# Altium project EG4D_PVS464MB.PrjPcb
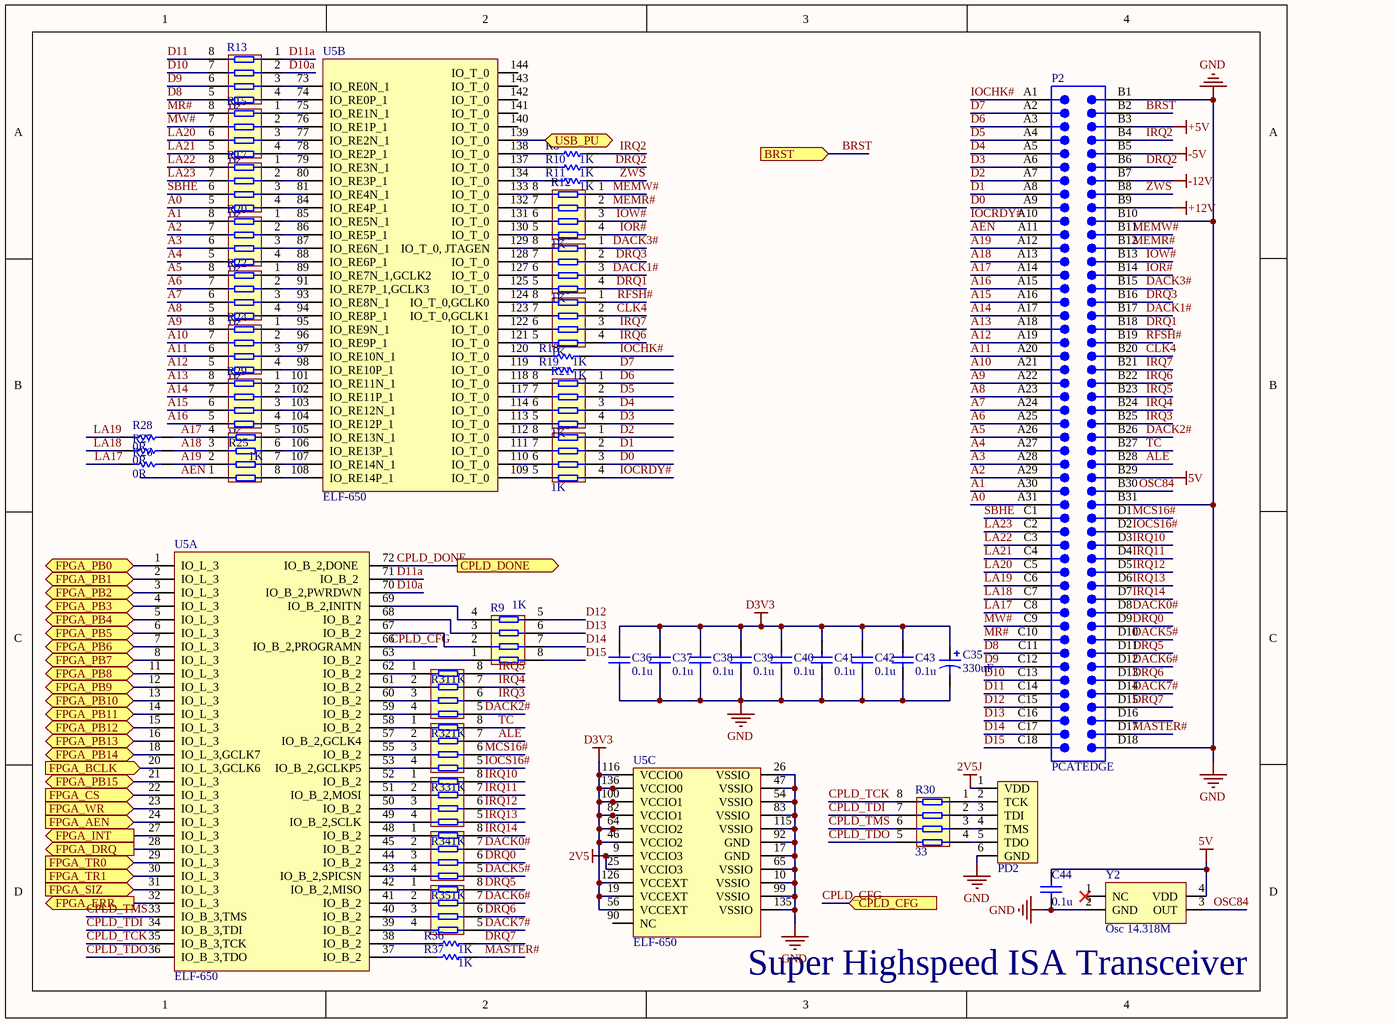
[diagram p0: AT short bus ( 7 x 4.2 inches).schdoc]
4 sheets, 180 parts. Net scope: flat (ports and power ports of the same name join across sheets).
Board file: AT short bus ( 7 x 4.2 inches).PCBDOC
Sheets:
  AT short bus ( 7 x 4.2 inches).schdoc
  MISC.SchDoc
  FPGA_CorePeripherals.SchDoc
  MEM.SchDoc

## Sheet AT short bus ( 7 x 4.2 inches).schdoc: AT short bus ( 7 x 4.2 inches)
size A; Organization: Organization; Address1: Address1; Address2: Address2; Address3: Address3; Address4: Address4; DocumentNumber: 1; Revision: 0; SheetNumber: 2; SheetTotal: 2

### Parts
C35  value 330uF  [TanCap-1210]  (hidden comment: 330u)
C36  value 0.1u  [0603C]  (hidden comment: Cap)
C37  value 0.1u  [0603C]  (hidden comment: Cap)
C38  value 0.1u  [0603C]  (hidden comment: Cap)
C39  value 0.1u  [0603C]  (hidden comment: Cap)
C40  value 0.1u  [0603C]  (hidden comment: Cap)
C41  value 0.1u  [0603C]  (hidden comment: Cap)
C42  value 0.1u  [0603C]  (hidden comment: Cap)
C43  value 0.1u  [0603C]  (hidden comment: Cap)
C44  value 0.1u  [0603C]  (hidden comment: Cap)
P2  PCATEDGE  [PCATEDGE]
PD2  JTAG  [DBGP7]  (value not drawn)
R8  value 1K  [0603R]  (hidden comment: Res1)
R9  1K  [YC164]
R10  value 1K  [0603R]  (hidden comment: Res1)
R11  value 1K  [0603R]  (hidden comment: Res1)
R12  1K  [YC164]
R13  1K  [YC164]
R14  1K  [YC164]
R15  1K  [YC164]
R16  1K  [YC164]
R17  1K  [YC164]
R18  value 1K  [0603R]  (hidden comment: Res1)
R19  value 1K  [0603R]  (hidden comment: Res1)
R20  1K  [YC164]
R21  1K  [YC164]
R22  1K  [YC164]
R23  1K  [YC164]
R24  1K  [YC164]
R25  1K  [YC164]
R26  value 0R  [0603R]  (hidden comment: Res1)
R27  value 0R  [0603R]  (hidden comment: Res1)
R28  value 0R  [0603R]  (hidden comment: Res1)
R29  1K  [YC164]
R30  33  [YC164]
R31  1K  [YC164]
R32  1K  [YC164]
R33  1K  [YC164]
R34  1K  [YC164]
R35  1K  [YC164]
R36  value 1K  [0603R]  (hidden comment: Res1)
R37  value 1K  [0603R]  (hidden comment: Res1)
U5  ELF-650  [LQFP144-1]  (parts A,B,C of 3)
Y2  Osc 14.318M  [XTAL-3225]

### Ports
BRST (in), CPLD_CFG (in), CPLD_DONE (out), FPGA_AEN (in), FPGA_BCLK (in), FPGA_CS (in), FPGA_DRQ (out), FPGA_ERR (out), FPGA_INT (out), FPGA_PB0 (bidir), FPGA_PB1 (bidir), FPGA_PB2 (bidir), FPGA_PB3 (bidir), FPGA_PB4 (bidir), FPGA_PB5 (bidir), FPGA_PB6 (bidir), FPGA_PB7 (bidir), FPGA_PB8 (bidir), FPGA_PB9 (bidir), FPGA_PB10 (bidir), FPGA_PB11 (bidir), FPGA_PB12 (bidir), FPGA_PB13 (bidir), FPGA_PB14 (bidir), FPGA_PB15 (bidir), FPGA_SIZ (in), FPGA_TR0 (in), FPGA_TR1 (in), FPGA_WR (in), USB_PU (bidir)

### Nets
2V5: U5.9(VCCIO3) U5.25(VCCIO3)
2V5J: PD2.1(VDD)
5V: C44.2 P2.B29 Y2.4(VDD)
+5V: P2.B3
+12V: P2.B9
-5V: P2.B5
-12V: P2.B7
D3V3: C35.1 C36.1 C37.1 C38.1 C39.1 C40.1 C41.1 C42.1 C43.1 U5.19(VCCEXT) U5.46(VCCIO2) U5.56(VCCEXT) U5.64(VCCIO2) U5.82(VCCIO1) U5.100(VCCIO1) U5.116(VCCIO0) U5.126(VCCEXT) U5.136(VCCIO0)
GND: C35.2 C36.2 C37.2 C38.2 C39.2 C40.2 C41.2 C42.2 C43.2 C44.1 P2.B1 P2.B10 P2.B31 P2.D18 PD2.6(GND) U5.10(VSSIO) U5.17(GND) U5.26(VSSIO) U5.47(VSSIO) U5.54(VSSIO) U5.65(VSSIO) U5.83(VSSIO) U5.92(GND) U5.99(VSSIO) U5.115(VSSIO) U5.135(VSSIO) Y2.2(GND)
A0: P2.A31 R17.5
A1: P2.A30 R20.8
A2: P2.A29 R20.7
A3: P2.A28 R20.6
A4: P2.A27 R20.5
A5: P2.A26 R22.8
A6: P2.A25 R22.7
A7: P2.A24 R22.6
A8: P2.A23 R22.5
A9: P2.A22 R24.8
A10: P2.A21 R24.7
A11: P2.A20 R24.6
A12: P2.A19 R24.5
A13: P2.A18 R29.8
A14: P2.A17 R29.7
A15: P2.A16 R29.6
A16: P2.A15 R29.5
A17: P2.A14 R25.4 R28.2
A18: P2.A13 R25.3 R27.2
A19: P2.A12 R25.2 R26.2
AEN: P2.A11 R25.1
ALE: P2.B28 R32.7
BRST: P2.B2 ; port BRST
CLK4: P2.B20 R16.2
CPLD_CFG: U5.66(IO_B_2,PROGRAMN) ; port CPLD_CFG
CPLD_DONE: U5.72(IO_B_2,DONE) ; port CPLD_DONE
CPLD_TCK: R30.8 U5.35(IO_B_3,TCK)
CPLD_TDI: R30.7 U5.34(IO_B_3,TDI)
CPLD_TDO: R30.5 U5.36(IO_B_3,TDO)
CPLD_TMS: R30.6 U5.33(IO_B_3,TMS)
D0: P2.A9 R23.3
D1: P2.A8 R23.2
D2: P2.A7 R23.1
D3: P2.A6 R21.4
D4: P2.A5 R21.3
D5: P2.A4 R21.2
D6: P2.A3 R21.1
D7: P2.A2 R19.1
D8: P2.C11 R13.5
D9: P2.C12 R13.6
D10: P2.C13 R13.7
D10a: R13.2 U5.70(IO_B_2,PWRDWN)
D11: P2.C14 R13.8
D11a: R13.1 U5.71(IO_B_2)
D12: P2.C15 R9.5
D13: P2.C16 R9.6
D14: P2.C17 R9.7
D15: P2.C18 R9.8
DACK0#: P2.D8 R34.7
DACK1#: P2.B17 R14.3
DACK2#: P2.B26 R31.5
DACK3#: P2.B15 R14.1
DACK5#: P2.D10 R34.5
DACK6#: P2.D12 R35.7
DACK7#: P2.D14 R35.5
DRQ0: P2.D9 R34.6
DRQ1: P2.B18 R14.4
DRQ2: P2.B6 R10.1
DRQ3: P2.B16 R14.2
DRQ5: P2.D11 R35.8
DRQ6: P2.D13 R35.6
DRQ7: P2.D15 R36.1
IOCHK#: P2.A1 R18.1
IOCRDY#: P2.A10 R23.4
IOCS16#: P2.D2 R32.5
IOR#: P2.B14 R12.4
IOW#: P2.B13 R12.3
IRQ2: P2.B4 R8.1
IRQ3: P2.B25 R31.6
IRQ4: P2.B24 R31.7
IRQ5: P2.B23 R31.8
IRQ6: P2.B22 R16.4
IRQ7: P2.B21 R16.3
IRQ10: P2.D3 R33.8
IRQ11: P2.D4 R33.7
IRQ12: P2.D5 R33.6
IRQ13: P2.D6 R33.5
IRQ14: P2.D7 R34.8
LA17: P2.C8 R26.1
LA18: P2.C7 R27.1
LA19: P2.C6 R28.1
LA20: P2.C5 R15.6
LA21: P2.C4 R15.5
LA22: P2.C3 R17.8
LA23: P2.C2 R17.7
MASTER#: P2.D17 R37.1
MCS16#: P2.D1 R32.6
MEMR#: P2.B12 R12.2
MEMW#: P2.B11 R12.1
MR#: P2.C10 R15.8
MW#: P2.C9 R15.7
OSC84: P2.B30 Y2.3(OUT)
RFSH#: P2.B19 R16.1
SBHE: P2.C1 R17.6
TC: P2.B27 R32.8
ZWS: P2.B8 R11.1
NetPD2_2: PD2.2(TCK) R30.1
NetPD2_3: PD2.3(TDI) R30.2
NetPD2_4: PD2.4(TMS) R30.3
NetPD2_5: PD2.5(TDO) R30.4
NetR8_2: R8.2 U5.138(IO_T_0)
NetR9_1: R9.1 U5.63(IO_B_2)
NetR9_2: R9.2 U5.67(IO_B_2)
NetR9_3: R9.3 U5.68(IO_B_2)
NetR9_4: R9.4 U5.69(IO_B_2,INITN)
NetR10_2: R10.2 U5.137(IO_T_0)
NetR11_2: R11.2 U5.134(IO_T_0)
NetR12_5: R12.5 U5.130(IO_T_0)
NetR12_6: R12.6 U5.131(IO_T_0)
NetR12_7: R12.7 U5.132(IO_T_0)
NetR12_8: R12.8 U5.133(IO_T_0)
NetR13_3: R13.3 U5.73(IO_RE0N_1)
NetR13_4: R13.4 U5.74(IO_RE0P_1)
NetR14_5: R14.5 U5.125(IO_T_0)
NetR14_6: R14.6 U5.127(IO_T_0)
NetR14_7: R14.7 U5.128(IO_T_0)
NetR14_8: R14.8 U5.129(IO_T_0,_JTAGEN)
NetR15_1: R15.1 U5.75(IO_RE1N_1)
NetR15_2: R15.2 U5.76(IO_RE1P_1)
NetR15_3: R15.3 U5.77(IO_RE2N_1)
NetR15_4: R15.4 U5.78(IO_RE2P_1)
NetR16_5: R16.5 U5.121(IO_T_0)
NetR16_6: R16.6 U5.122(IO_T_0)
NetR16_7: R16.7 U5.123(IO_T_0,GCLK1)
NetR16_8: R16.8 U5.124(IO_T_0,GCLK0)
NetR17_1: R17.1 U5.79(IO_RE3N_1)
NetR17_2: R17.2 U5.80(IO_RE3P_1)
NetR17_3: R17.3 U5.81(IO_RE4N_1)
NetR17_4: R17.4 U5.84(IO_RE4P_1)
NetR18_2: R18.2 U5.120(IO_T_0)
NetR19_2: R19.2 U5.119(IO_T_0)
NetR20_1: R20.1 U5.85(IO_RE5N_1)
NetR20_2: R20.2 U5.86(IO_RE5P_1)
NetR20_3: R20.3 U5.87(IO_RE6N_1)
NetR20_4: R20.4 U5.88(IO_RE6P_1)
NetR21_5: R21.5 U5.113(IO_T_0)
NetR21_6: R21.6 U5.114(IO_T_0)
NetR21_7: R21.7 U5.117(IO_T_0)
NetR21_8: R21.8 U5.118(IO_T_0)
NetR22_1: R22.1 U5.89(IO_RE7N_1,GCLK2)
NetR22_2: R22.2 U5.91(IO_RE7P_1,GCLK3)
NetR22_3: R22.3 U5.93(IO_RE8N_1)
NetR22_4: R22.4 U5.94(IO_RE8P_1)
NetR23_5: R23.5 U5.109(IO_T_0)
NetR23_6: R23.6 U5.110(IO_T_0)
NetR23_7: R23.7 U5.111(IO_T_0)
NetR23_8: R23.8 U5.112(IO_T_0)
NetR24_1: R24.1 U5.95(IO_RE9N_1)
NetR24_2: R24.2 U5.96(IO_RE9P_1)
NetR24_3: R24.3 U5.97(IO_RE10N_1)
NetR24_4: R24.4 U5.98(IO_RE10P_1)
NetR25_5: R25.5 U5.105(IO_RE13N_1)
NetR25_6: R25.6 U5.106(IO_RE13P_1)
NetR25_7: R25.7 U5.107(IO_RE14N_1)
NetR25_8: R25.8 U5.108(IO_RE14P_1)
NetR29_1: R29.1 U5.101(IO_RE11N_1)
NetR29_2: R29.2 U5.102(IO_RE11P_1)
NetR29_3: R29.3 U5.103(IO_RE12N_1)
NetR29_4: R29.4 U5.104(IO_RE12P_1)
NetR31_1: R31.1 U5.62(IO_B_2)
NetR31_2: R31.2 U5.61(IO_B_2)
NetR31_3: R31.3 U5.60(IO_B_2)
NetR31_4: R31.4 U5.59(IO_B_2)
NetR32_1: R32.1 U5.58(IO_B_2)
NetR32_2: R32.2 U5.57(IO_B_2,GCLK4)
NetR32_3: R32.3 U5.55(IO_B_2)
NetR32_4: R32.4 U5.53(IO_B_2,GCLKP5)
NetR33_1: R33.1 U5.52(IO_B_2)
NetR33_2: R33.2 U5.51(IO_B_2,MOSI)
NetR33_3: R33.3 U5.50(IO_B_2)
NetR33_4: R33.4 U5.49(IO_B_2,SCLK)
NetR34_1: R34.1 U5.48(IO_B_2)
NetR34_2: R34.2 U5.45(IO_B_2)
NetR34_3: R34.3 U5.44(IO_B_2)
NetR34_4: R34.4 U5.43(IO_B_2,SPICSN)
NetR35_1: R35.1 U5.42(IO_B_2,MISO)
NetR35_2: R35.2 U5.41(IO_B_2)
NetR35_3: R35.3 U5.40(IO_B_2)
NetR35_4: R35.4 U5.39(IO_B_2)
NetR36_2: R36.2 U5.38(IO_B_2)
NetR37_2: R37.2 U5.37(IO_B_2)
NetR52_1: U5.139(IO_T_0) ; port USB_PU
NetU1_2: U5.32(IO_L_3) ; port FPGA_ERR
NetU1_3: U5.31(IO_L_3) ; port FPGA_SIZ
NetU1_4: U5.30(IO_L_3) ; port FPGA_TR1
NetU1_6: U5.29(IO_L_3) ; port FPGA_TR0
NetU1_8: U5.28(IO_L_3) ; port FPGA_DRQ
NetU1_11: U5.27(IO_L_3) ; port FPGA_INT
NetU1_14: U5.24(IO_L_3) ; port FPGA_AEN
NetU1_15: U5.23(IO_L_3) ; port FPGA_WR
NetU1_16: U5.22(IO_L_3) ; port FPGA_CS
NetU1_17: U5.21(IO_L_3) ; port FPGA_PB15
NetU1_19: U5.20(IO_L_3,GCLK6) ; port FPGA_BCLK
NetU1_22: U5.18(IO_L_3,GCLK7) ; port FPGA_PB14
NetU1_23: U5.16(IO_L_3) ; port FPGA_PB13
NetU1_25: U5.15(IO_L_3) ; port FPGA_PB12
NetU1_26: U5.14(IO_L_3) ; port FPGA_PB11
NetU1_27: U5.13(IO_L_3) ; port FPGA_PB10
NetU1_28: U5.12(IO_L_3) ; port FPGA_PB9
NetU1_29: U5.11(IO_L_3) ; port FPGA_PB8
NetU1_30: U5.8(IO_L_3) ; port FPGA_PB7
NetU1_31: U5.7(IO_L_3) ; port FPGA_PB6
NetU1_32: U5.6(IO_L_3) ; port FPGA_PB5
NetU1_35: U5.5(IO_L_3) ; port FPGA_PB4
NetU1_36: U5.4(IO_L_3) ; port FPGA_PB3
NetU1_37: U5.3(IO_L_3) ; port FPGA_PB2
NetU1_39: U5.2(IO_L_3) ; port FPGA_PB1
NetU1_41: U5.1(IO_L_3) ; port FPGA_PB0

Not connected (* = marked no-connect by the designer): P2 D16; U5 90(NC_) 140(IO_T_0) 141(IO_T_0) 142(IO_T_0) 143(IO_T_0) 144(IO_T_0); Y2 1(NC)*

### Notes on the sheet
- Super Highspeed ISA Transceiver

### Library data of the parts
C35 = Cap Pol1: Polarized Capacitor (Radial); Published: 8-Jun-2000; LatestRevisionDate: 17-Jul-2002; LatestRevisionNote: Re-released for DXP Platform.; PackageReference: RB7.6-15; Publisher: Altium Limited; PackageDescription: Polarized Capacitor (Radial); 2 Leads
C36-C44 = Cap: Capacitor; Published: 8-Jun-2000; LatestRevisionDate: 17-Jul-2002; LatestRevisionNote: Re-released for DXP Platform.; PackageReference: RAD-0.3; Publisher: Altium Limited; PackageDescription: Radial Cap, Thru-Hole; 2 Leads; 0.3 in Pin Spacing
P2 = PCATEDGE: Card, 98-Position; Text Field6: Alternate Layout Available; Text Field7: Published 14-Feb-2002
R8 R10 R11 R18 R19 R26-R28 R36 R37 = Res1: Resistor; Published: 8-Jun-2000; LatestRevisionDate: 17-Jul-2002; LatestRevisionNote: Re-released for DXP Platform.; PackageReference: AXIAL-0.3; Publisher: Altium Limited; PackageDescription: Axial Device, Thru-Hole; 2 Leads; 0.3 in Pin Spacing
R9 R12-R17 R20-R25 R29-R35 = ResPak-8P4R
U5 = EF1A650LQ144: GP CPLD
Y2 = OSC

## Sheet MISC.SchDoc
size A4
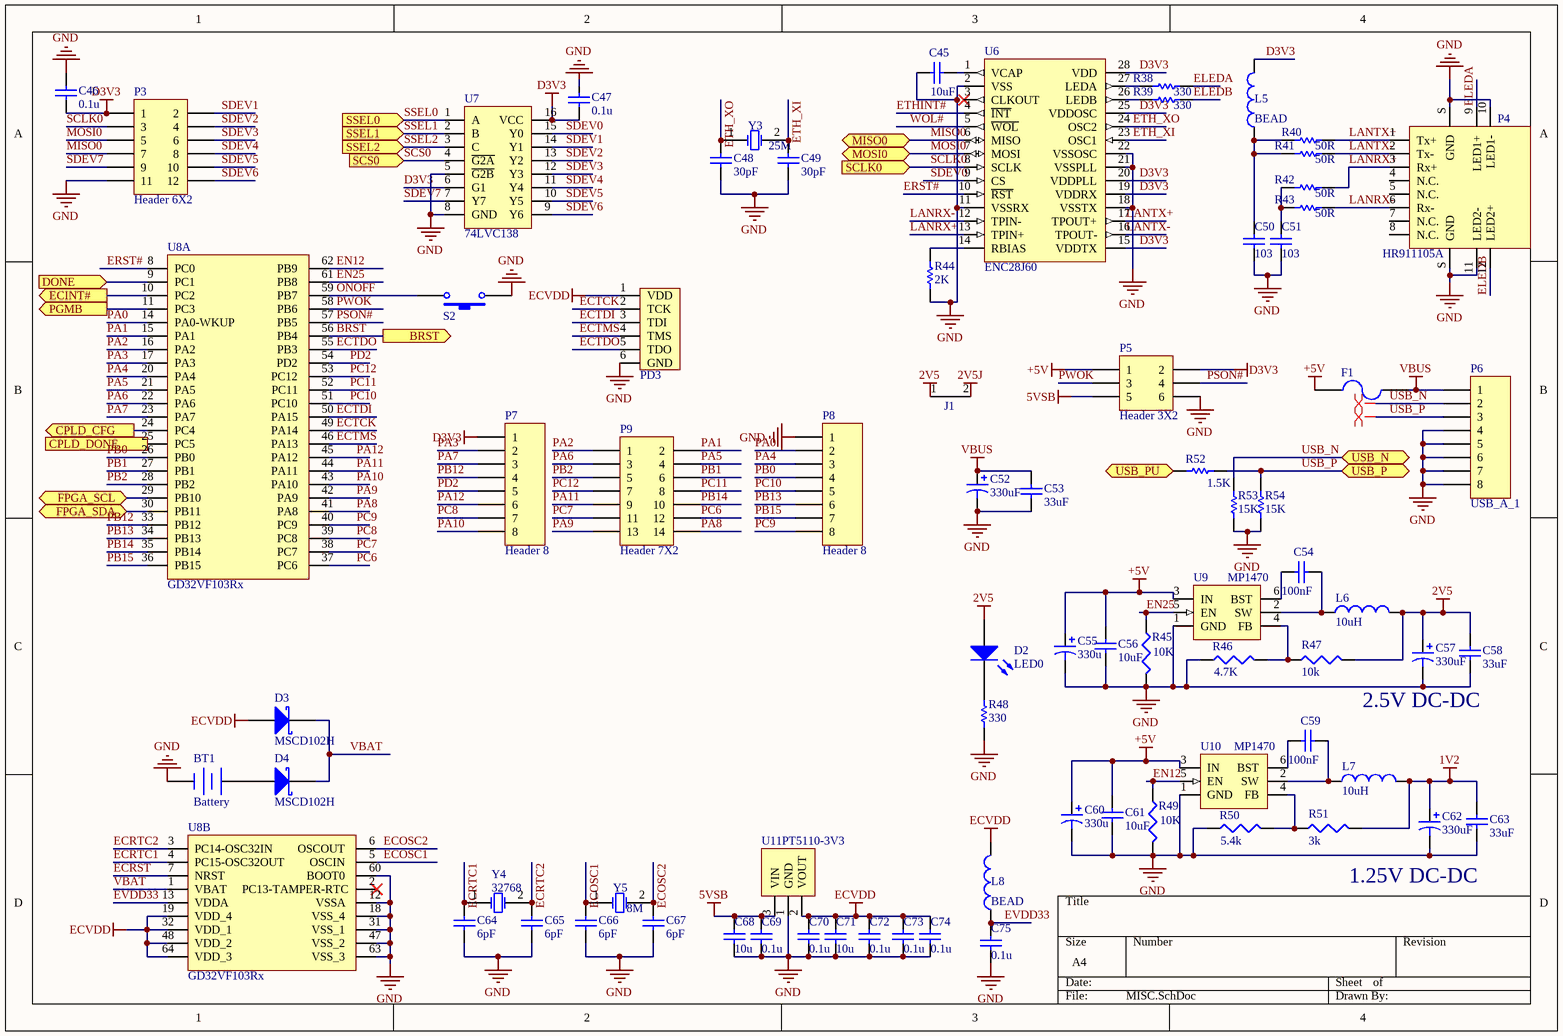
[diagram p1: MISC.SchDoc]

### Parts
BT1  Battery  [BAT-CR1220]
C45  value 10uF  [0603C]  (hidden comment: Cap)
C46  value 0.1u  [0603C]  (hidden comment: Cap)
C47  value 0.1u  [0603C]  (hidden comment: Cap)
C48  value 30pF  [0603C]  (hidden comment: Cap)
C49  value 30pF  [0603C]  (hidden comment: Cap)
C50  value 103  [0603C]  (hidden comment: Cap)
C51  value 103  [0603C]  (hidden comment: Cap)
C52  value 330uF  [TanCap-1210]  (hidden comment: 330u)
C53  value 33uF  [0603C]  (hidden comment: 106)
C54  value 100nF  [0603C]  (hidden comment: 104)
C55  330u  [TanCap-1210]
C56  value 10uF  [0603C]  (hidden comment: 106)
C57  value 330uF  [TanCap-1210]  (hidden comment: 330u)
C58  value 33uF  [0603C]  (hidden comment: 106)
C59  value 100nF  [0603C]  (hidden comment: 104)
C60  330u  [TanCap-1210]
C61  value 10uF  [0603C]  (hidden comment: 106)
C62  value 330uF  [TanCap-1210]  (hidden comment: 330u)
C63  value 33uF  [0603C]  (hidden comment: 106)
C64  value 6pF  [0603C]  (hidden comment: Cap)
C65  value 6pF  [0603C]  (hidden comment: Cap)
C66  value 6pF  [0603C]  (hidden comment: Cap)
C67  value 6pF  [0603C]  (hidden comment: Cap)
C68  value 10u  [0603C]  (hidden comment: Cap)
C69  value 0.1u  [0603C]  (hidden comment: Cap)
C70  value 0.1u  [0603C]  (hidden comment: Cap)
C71  value 10u  [0603C]  (hidden comment: Cap)
C72  value 0.1u  [0603C]  (hidden comment: Cap)
C73  value 0.1u  [0603C]  (hidden comment: Cap)
C74  value 0.1u  [0603C]  (hidden comment: Cap)
C75  value 0.1u  [0603C]  (hidden comment: Cap)
D2  LED0  [0805LED1]
D3  MSCD102H  [0805LED2]
D4  MSCD102H  [0805LED2]
F1  Fuse 2  [Fusebux_5x20]  (value not drawn)
J1  Jumper  [Jumper 10mm]  (value not drawn)
L5  value BEAD  [0603C]  (hidden comment: Inductor)
L6  10uH  [PIND0650]
L7  10uH  [PIND0650]
L8  value BEAD  [0603C]  (hidden comment: Inductor)
P3  Header 6X2  [HDR2X6]
P4  HR911105A  [HR911105A]
P5  Header 3X2  [PWRCONN-6P]
P6  USB_A_1  [USB-A_1]
P7  Header 8  [HDR1X8]
P8  Header 8  [HDR1X8]
P9  Header 7X2  [HDR2X7_U]
PD3  JTAG  [DBGP7]  (value not drawn)
R38  value 330  [0603R]  (hidden comment: Res1)
R39  value 330  [0603R]  (hidden comment: Res1)
R40  value 50R  [0603R]  (hidden comment: Res1)
R41  value 50R  [0603R]  (hidden comment: Res1)
R42  value 50R  [0603R]  (hidden comment: Res1)
R43  value 50R  [0603R]  (hidden comment: Res1)
R44  value 2K  [0603R]  (hidden comment: Res1)
R45  10K  [0603R]
R46  value 4.7K  [0603R]  (hidden comment: 3K2)
R47  10K  [0603R]
R48  value 330  [0603R]  (hidden comment: Res1)
R49  10K  [0603R]
R50  value 5.4k  [0603R]  (hidden comment: 3K2)
R51  value 3k  [0603R]  (hidden comment: 10K)
R52  value 1.5K  [0603R]  (hidden comment: Res1)
R53  value 15K  [0603R]  (hidden comment: Res1)
R54  value 15K  [0603R]  (hidden comment: Res1)
S2  SW-PB  [Switch_SMT-022S-H2.5]  (value not drawn)
U6  ENC28J60  [SOIC28P1040X265]
U7  74LVC138  [SO-16]
U8  GD32VF103Rx  [QFP12X12-64(N)]  (parts A,B of 2)
U9  MP1470  [SOT95P245X110-6N]
U10  MP1470  [SOT95P245X110-6N]
U11  PT5110-3V3  [SOT323-N]
Y3  25M  [XTAL-5032]
Y4  32768  [XTAL-3215]
Y5  8M  [XTAL-5032]

### Ports
BRST (out), CPLD_CFG (out), CPLD_DONE (in), DONE (in), ECINT# (out), FPGA_SCL (bidir), FPGA_SDA (bidir), MISO0 (bidir), MOSI0 (bidir), PGMB (out), SCLK0 (in), SCS0 (in), SSEL0 (in), SSEL1 (in), SSEL2 (in), USB_N (bidir), USB_P (bidir), USB_PU (bidir)

### Nets
1V2: C62.1 C63.2 L7.2 R51.2
2V5: C57.1 C58.2 D2.1(A) J1.1 L6.2 R47.2
2V5J: J1.2
5VSB: C68.2 C69.2 P5.5 U11.3(VIN)
+5V: C55.1 C56.2 C60.1 C61.2 F1.1 P5.1 U9.3(IN) U10.3(IN)
D3V3: C46.2 C47.2 L5.2 P3.1 P5.2 P7.1 U6.15(VDDTX) U6.19(VDDRX) U6.20(VDDPLL) U6.25(VDDOSC) U6.28(VDD) U7.6(G1) U7.16(VCC)
ECVDD: C70.2 C71.2 C72.2 C73.2 C74.2 D3.1(A) L8.2 PD3.1(VDD) U8.19(VDD_4) U8.32(VDD_1) U8.48(VDD_2) U8.64(VDD_3) U11.2(VOUT)
GND: BT1.2(-) C45.2 C46.1 C47.1 C48.2 C49.2 C50.1 C51.1 C52.2 C53.1 C55.2 C56.1 C57.2 C58.1 C60.2 C61.1 C62.2 C63.1 C64.2 C65.2 C66.2 C67.2 C68.1 C69.1 C70.1 C71.1 C72.1 C73.1 C74.1 C75.1 P3.11 P4.10(LED1-) P4.11(LED2-) P4.S(GND) P5.6 P6.4 P6.5 P6.6 P6.7 P6.8 P8.1 PD3.6(GND) R44.2 R45.2 R46.1 R48.2 R49.2 R50.1 R53.2 R54.2 S2.1 U6.2(VSS) U6.11(VSSRX) U6.18(VSSTX) U6.21(VSSPLL) U6.22(VSSOSC) U7.5(~{G2B}) U7.8(GND) U8.12(VSSA) U8.18(VSS_4) U8.31(VSS_1) U8.47(VSS_2) U8.60(BOOT0) U8.63(VSS_3) U9.1(GND) U10.1(GND) U11.1(GND)
VBUS: C52.1 C53.2 F1.2 P6.1
BRST: U8.56(PB4) ; port BRST
CPLD_CFG: U8.24(PC4) ; port CPLD_CFG
CPLD_DONE: U8.25(PC5) ; port CPLD_DONE
DONE: U8.9(PC1) ; port DONE
ECOSC1: C66.1 U8.5(OSCIN) Y5.1(OSC1)
ECOSC2: C67.1 U8.6(OSCOUT) Y5.2(OSC2)
ECRST: U8.7(NRST)
ECRTC1: C64.1 U8.4(PC15-OSC32OUT) Y4.1(OSC1)
ECRTC2: C65.1 U8.3(PC14-OSC32IN) Y4.2(OSC2)
ECTCK: PD3.2(TCK) U8.49(PA14)
ECTDI: PD3.3(TDI) U8.50(PA15)
ECTDO: PD3.5(TDO) U8.55(PB3)
ECTMS: PD3.4(TMS) U8.46(PA13)
ELEDA: P4.9(LED1+) R38.1
ELEDB: P4.12(LED2+) R39.1
EN12: R49.1 U8.62(PB9) U10.5(EN)
EN25: R45.1 U8.61(PB8) U9.5(EN)
ERST#: U6.10(~{RST}) U8.8(PC0)
ETH_XI: C49.1 U6.23(OSC1) Y3.2(OSC2)
ETH_XO: C48.1 U6.24(OSC2) Y3.1(OSC1)
ETHINT#: U6.4(~{INT})
EVDD33: C75.2 L8.1 U8.13(VDDA)
INITB: U8.10(PC2) ; port ECINT#
LANRX+: P4.3(Rx+) R42.1 U6.13(TPIN+)
LANRX-: P4.6(Rx-) R43.1 U6.12(TPIN-)
LANTX+: P4.1(Tx+) R40.1 U6.17(TPOUT+)
LANTX-: P4.2(Tx-) R41.1 U6.16(TPOUT-)
MISO0: P3.7 U6.6(MISO) ; port MISO0
MOSI0: P3.5 U6.7(MOSI) ; port MOSI0
ONOFF: S2.2 U8.59(PB7)
PA0: P8.2 U8.14(PA0-WKUP)
PA1: P9.2 U8.15(PA1)
PA2: P9.1 U8.16(PA2)
PA3: P7.2 U8.17(PA3)
PA4: P8.3 U8.20(PA4)
PA5: P9.4 U8.21(PA5)
PA6: P9.3 U8.22(PA6)
PA7: P7.3 U8.23(PA7)
PA8: P9.14 U8.41(PA8)
PA9: P9.13 U8.42(PA9)
PA10: P7.8 U8.43(PA10)
PA11: P9.9 U8.44(PA11)
PA12: P7.6 U8.45(PA12)
PB0: P8.4 U8.26(PB0)
PB1: P9.6 U8.27(PB1)
PB2: P9.5 U8.28(PB2)
PB12: P7.4 U8.33(PB12)
PB13: P8.6 U8.34(PB13)
PB14: P9.10 U8.35(PB14)
PB15: P8.7 U8.36(PB15)
PC6: P9.12 U8.37(PC6)
PC7: P9.11 U8.38(PC7)
PC8: P7.7 U8.39(PC8)
PC9: P8.8 U8.40(PC9)
PC10: P8.5 U8.51(PC10)
PC11: P9.8 U8.52(PC11)
PC12: P9.7 U8.53(PC12)
PD2: P7.5 U8.54(PD2)
PGMB: U8.11(PC3) ; port PGMB
PSON#: P5.4 U8.57(PB5)
PWOK: P5.3 U8.58(PB6)
SCLK0: P3.3 U6.8(SCLK) ; port SCLK0
SCS0: U7.4(~{G2A}) ; port SCS0
SDEV0: U6.9(CS) U7.15(Y0)
SDEV1: P3.2 U7.14(Y1)
SDEV2: P3.4 U7.13(Y2)
SDEV3: P3.6 U7.12(Y3)
SDEV4: P3.8 U7.11(Y4)
SDEV5: P3.10 U7.10(Y5)
SDEV6: P3.12 U7.9(Y6)
SDEV7: P3.9 U7.7(Y7)
SSEL0: U7.1(A) ; port SSEL0
SSEL1: U7.2(B) ; port SSEL1
SSEL2: U7.3(C) ; port SSEL2
USB_N: P6.2 R53.1 ; port USB_N
USB_P: P6.3 R52.2 R54.1 ; port USB_P
VBAT: D3.2(K) D4.2(K) U8.1(VBAT)
WOL#: U6.5(~{WOL})
NetBT1_1: BT1.1(+) D4.1(A)
NetC45_1: C45.1 U6.1(VCAP)
NetC50_2: C50.2 L5.1 R40.2 R41.2
NetC51_2: C51.2 R42.2 R43.2
NetC54_1: C54.1 L6.1 U9.2(SW)
NetC54_2: C54.2 U9.6(BST)
NetC59_1: C59.1 L7.1 U10.2(SW)
NetC59_2: C59.2 U10.6(BST)
NetD2_2: D2.2(K) R48.1
NetP10_71: U8.29(PB10) ; port FPGA_SCL
NetP10_72: U8.30(PB11) ; port FPGA_SDA
NetR38_2: R38.2 U6.27(LEDA)
NetR39_2: R39.2 U6.26(LEDB)
NetR44_1: R44.1 U6.14(RBIAS)
NetR46_2: R46.2 R47.1 U9.4(FB)
NetR50_2: R50.2 R51.1 U10.4(FB)
NetR52_1: R52.1 ; port USB_PU

Not connected (* = marked no-connect by the designer): P4 4(N.C.) 5(N.C.) 7(N.C.) 8(N.C.); U6 3(CLKOUT)*; U8 2(PC13-TAMPER-RTC)*

### Layout directives
differential pair: USB_N, USB_P

### Notes on the sheet
- 2.5V DC-DC
- 1.25V DC-DC

### Library data of the parts
BT1 = Battery: Multicell Battery; Published: 24-Mar-1999; LatestRevisionDate: 17-Jul-2002; LatestRevisionNote: Re-released for DXP Platform.; PackageReference: BAT-2; Publisher: Altium Limited; PackageDescription: Battery; 2 Leads
C45-C51 C64-C75 = Cap: Capacitor; Published: 8-Jun-2000; LatestRevisionDate: 17-Jul-2002; LatestRevisionNote: Re-released for DXP Platform.; PackageReference: RAD-0.3; Publisher: Altium Limited; PackageDescription: Radial Cap, Thru-Hole; 2 Leads; 0.3 in Pin Spacing
C52 C55 C57 C60 C62 = Cap Pol1: Polarized Capacitor (Radial); Published: 8-Jun-2000; LatestRevisionDate: 17-Jul-2002; LatestRevisionNote: Re-released for DXP Platform.; PackageReference: RB7.6-15; Publisher: Altium Limited; PackageDescription: Polarized Capacitor (Radial); 2 Leads
  C55 C60: Value: 330u
C53 C54 C56 C58 C59 C61 C63 = Cap: Ceramic Capacitor 0603; Published: 8-Jun-2000; LatestRevisionDate: 17-Jul-2002; LatestRevisionNote: Re-released for DXP Platform.; PackageReference: RAD-0.3; Publisher: Altium Limited; PackageDescription: Radial Cap, Thru-Hole; 2 Leads; 0.3 in Pin Spacing
D2 = LED0: Typical INFRARED GaAs LED; Published: 8-Jun-2000; LatestRevisionDate: 08-Jul-2005; LatestRevisionNote: Mech Layer 1 removed.; PackageReference: LED-0; Publisher: Altium Limited; PackageDescription: LED; 2 Leads
D3 D4 = D Schottky: Schottky Diode; Published: 8-Jun-2000; LatestRevisionDate: 17-Jul-2002; LatestRevisionNote: Re-released for DXP Platform.; PackageReference: SMB; Publisher: Altium Limited; PackageDescription: DO-214-AA/SMB; 2 C-Bend Leads; Body 5.3 x 3.6 mm, inc. leads (LxW); Code_JEDEC: DO-214-AA
F1 = Fuse 2: Fuse; Published: 8-Jun-2000; LatestRevisionDate: 17-Jul-2002; LatestRevisionNote: Re-released for DXP Platform.; PackageReference: PIN-W2/E2.8; Publisher: Altium Limited; PackageDescription: Thru-Hole; 2 Leads
L5 L8 = Inductor: Code_IEC: 1005; Published: 8-Jun-2000; LatestRevisionDate: 29-May-2009; LatestRevisionNote: IPC-7351 Footprint Added.; PackageReference: 0402-A; Publisher: Altium Limited; PackageDescription: Chip Inductor; Code_JEITA: 0402
L6 L7 = Inductor: Inductor 0606; Code_IEC: 1005; Published: 8-Jun-2000; LatestRevisionDate: 29-May-2009; LatestRevisionNote: IPC-7351 Footprint Added.; PackageReference: 0402-A; Publisher: Altium Limited; PackageDescription: Chip Inductor; Code_JEITA: 0402; Value: 10uH
P3 = Header 6X2: Header, 6-Pin, Dual row; LatestRevisionDate: 17-Jul-2002; LatestRevisionNote: Re-released for DXP Platform.; Publisher: Altium Limited
P5 = Header 3X2: Header, 3-Pin, Dual row; LatestRevisionDate: 17-Jul-2002; LatestRevisionNote: Re-released for DXP Platform.; Publisher: Altium Limited
P6-P8 = Header 8: Header, 8-Pin; LatestRevisionDate: 17-Jul-2002; LatestRevisionNote: Re-released for DXP Platform.; Publisher: Altium Limited
P9 = Header 7X2: Header, 7-Pin, Dual row; LatestRevisionDate: 17-Jul-2002; LatestRevisionNote: Re-released for DXP Platform.; Publisher: Altium Limited
R38-R44 R48 R52-R54 = Res1: Resistor; Published: 8-Jun-2000; LatestRevisionDate: 17-Jul-2002; LatestRevisionNote: Re-released for DXP Platform.; PackageReference: AXIAL-0.3; Publisher: Altium Limited; PackageDescription: Axial Device, Thru-Hole; 2 Leads; 0.3 in Pin Spacing
R45-R47 R49-R51 = Res3: Resistor; Published: 8-Jun-2000; LatestRevisionDate: 29-May-2009; LatestRevisionNote: IPC-7351 Footprint Added.; PackageReference: J1-0603; Publisher: Altium Limited; PackageDescription: Chip Resistor
  R45 R49: Value: 10K
  R47: Value: 10k
S2 = SW-PB: Switch; Published: 24-Mar-1999; LatestRevisionDate: 17-Jul-2002; LatestRevisionNote: Re-released for DXP Platform.; PackageReference: SPST-2; Publisher: Altium Limited; PackageDescription: Switch; 2 Leads
U7 = 74x138
U11 = PT5110
Y3-Y5 = XTAL: Crystal Oscillator; Published: 8-Jun-2000; LatestRevisionDate: 17-Jul-2002; LatestRevisionNote: Re-released for DXP Platform.; PackageReference: R38; Publisher: Altium Limited; PackageDescription: Crystal, Thru-Hole; 2 Leads; Body 3.1 x 8.2 mm (Dia.xH)

## Sheet FPGA_CorePeripherals.SchDoc
size A4
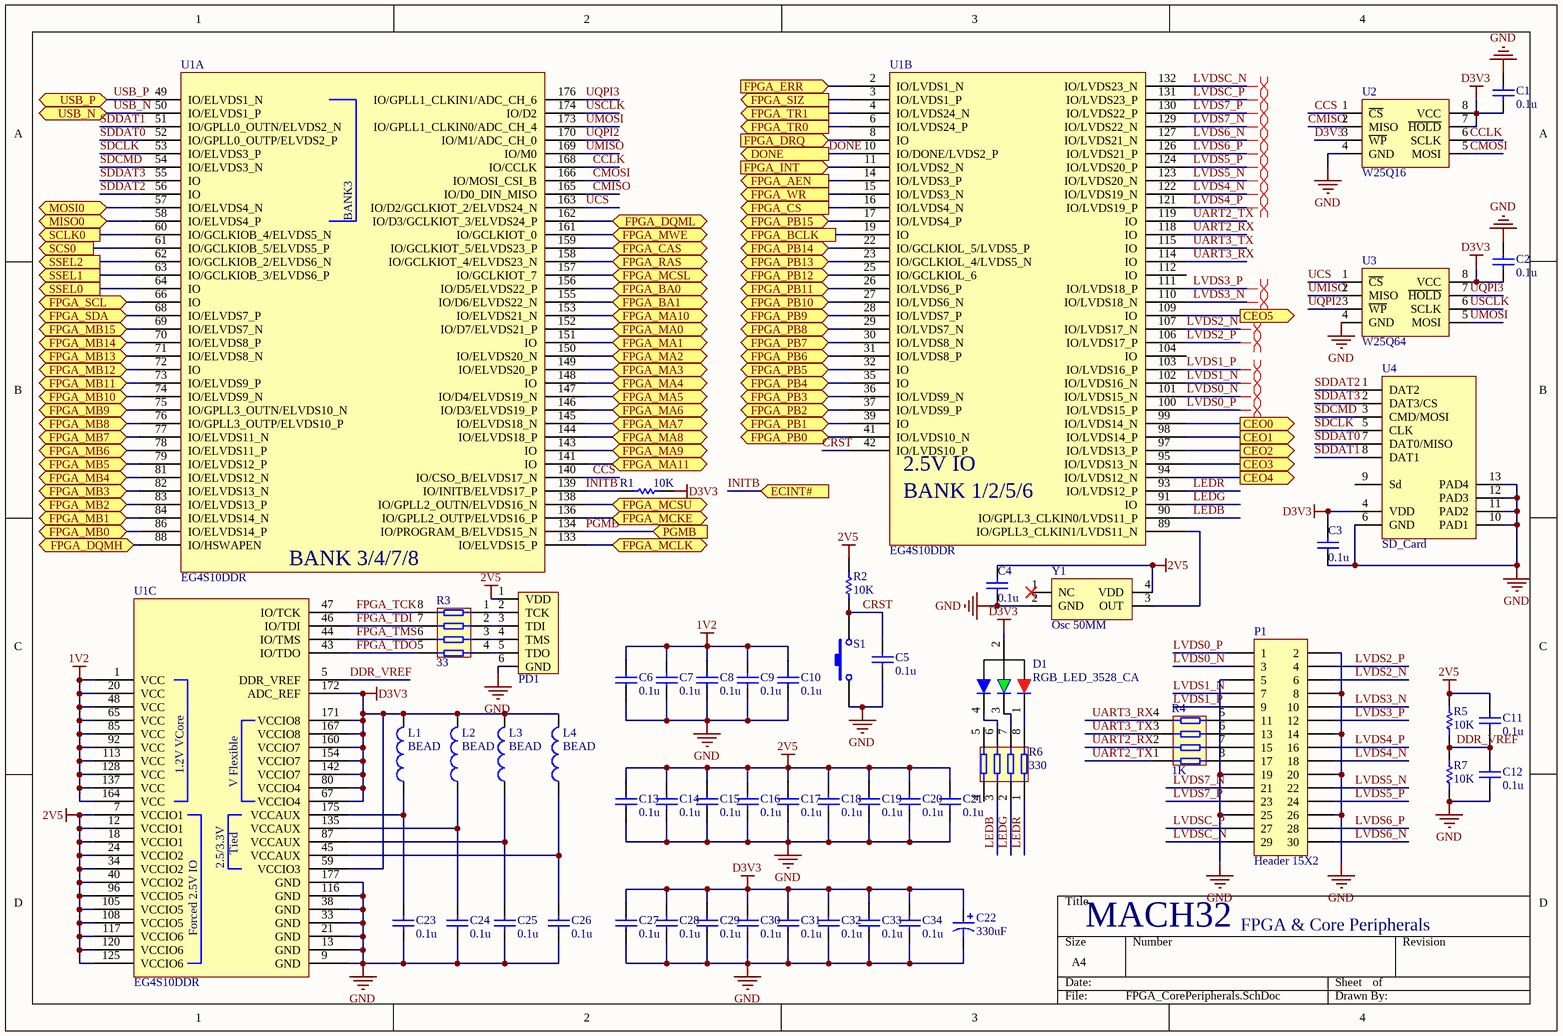
[diagram p2: FPGA_CorePeripherals.SchDoc]

### Parts
C1  value 0.1u  [0603C]  (hidden comment: Cap)
C2  value 0.1u  [0603C]  (hidden comment: Cap)
C3  value 0.1u  [0603C]  (hidden comment: Cap)
C4  value 0.1u  [0603C]  (hidden comment: Cap)
C5  value 0.1u  [0603C]  (hidden comment: Cap)
C6  value 0.1u  [0603C]  (hidden comment: Cap)
C7  value 0.1u  [0603C]  (hidden comment: Cap)
C8  value 0.1u  [0603C]  (hidden comment: Cap)
C9  value 0.1u  [0603C]  (hidden comment: Cap)
C10  value 0.1u  [0603C]  (hidden comment: Cap)
C11  value 0.1u  [0603C]  (hidden comment: Cap)
C12  value 0.1u  [0603C]  (hidden comment: Cap)
C13  value 0.1u  [0603C]  (hidden comment: Cap)
C14  value 0.1u  [0603C]  (hidden comment: Cap)
C15  value 0.1u  [0603C]  (hidden comment: Cap)
C16  value 0.1u  [0603C]  (hidden comment: Cap)
C17  value 0.1u  [0603C]  (hidden comment: Cap)
C18  value 0.1u  [0603C]  (hidden comment: Cap)
C19  value 0.1u  [0603C]  (hidden comment: Cap)
C20  value 0.1u  [0603C]  (hidden comment: Cap)
C21  value 0.1u  [0603C]  (hidden comment: Cap)
C22  value 330uF  [TanCap-1210]  (hidden comment: 330u)
C23  value 0.1u  [0603C]  (hidden comment: Cap)
C24  value 0.1u  [0603C]  (hidden comment: Cap)
C25  value 0.1u  [0603C]  (hidden comment: Cap)
C26  value 0.1u  [0603C]  (hidden comment: Cap)
C27  value 0.1u  [0603C]  (hidden comment: Cap)
C28  value 0.1u  [0603C]  (hidden comment: Cap)
C29  value 0.1u  [0603C]  (hidden comment: Cap)
C30  value 0.1u  [0603C]  (hidden comment: Cap)
C31  value 0.1u  [0603C]  (hidden comment: Cap)
C32  value 0.1u  [0603C]  (hidden comment: Cap)
C33  value 0.1u  [0603C]  (hidden comment: Cap)
C34  value 0.1u  [0603C]  (hidden comment: Cap)
D1  RGB_LED_3528_CA  [LED3528-RGB]
L1  value BEAD  [0603C]  (hidden comment: Inductor)
L2  value BEAD  [0603C]  (hidden comment: Inductor)
L3  value BEAD  [0603C]  (hidden comment: Inductor)
L4  value BEAD  [0603C]  (hidden comment: Inductor)
P1  Header 15X2  [BTB_1.27mm_2x10_SMT]
PD1  JTAG  [DBGP7]  (value not drawn)
R1  value 10K  [0603R]  (hidden comment: Res1)
R2  value 10K  [0603R]  (hidden comment: Res1)
R3  33  [YC164]
R4  1K  [YC164]
R5  value 10K  [0603R]  (hidden comment: Res1)
R6  330  [YC164]
R7  value 10K  [0603R]  (hidden comment: Res1)
S1  SW-PB  [Switch_SMT-022S-H2.5]  (value not drawn)
U1  EG4S10DDR  [EQFP176]  (parts A,B,C of 3)
U2  W25Q16  [SOP8N-127P600X200]
U3  W25Q64  [DIP8]
U4  SD_Card  [TF_self-eject]
Y1  Osc 50MM  [XTAL-3225]

### Ports
CEO0 (out), CEO1 (out), CEO2 (out), CEO3 (out), CEO4 (out), CEO5 (out), DONE (out), ECINT# (in), FPGA_AEN (out), FPGA_BA0 (bidir), FPGA_BA1 (bidir), FPGA_BCLK (out), FPGA_CAS (bidir), FPGA_CS (out), FPGA_DQMH (bidir), FPGA_DQML (bidir), FPGA_DRQ (in), FPGA_ERR (in), FPGA_INT (in), FPGA_MA0 (bidir), FPGA_MA1 (bidir), FPGA_MA2 (bidir), FPGA_MA3 (bidir), FPGA_MA4 (bidir), FPGA_MA5 (bidir), FPGA_MA6 (bidir), FPGA_MA7 (bidir), FPGA_MA8 (bidir), FPGA_MA9 (bidir), FPGA_MA10 (bidir), FPGA_MA11 (bidir), FPGA_MB0 (bidir), FPGA_MB1 (bidir), FPGA_MB2 (bidir), FPGA_MB3 (bidir), FPGA_MB4 (bidir), FPGA_MB5 (bidir), FPGA_MB6 (bidir), FPGA_MB7 (bidir), FPGA_MB8 (bidir), FPGA_MB9 (bidir), FPGA_MB10 (bidir), FPGA_MB11 (bidir), FPGA_MB12 (bidir), FPGA_MB13 (bidir), FPGA_MB14 (bidir), FPGA_MB15 (bidir), FPGA_MCKE (bidir), FPGA_MCLK (bidir), FPGA_MCSL (bidir), FPGA_MCSU (bidir), FPGA_MWE (bidir), FPGA_PB0 (bidir), FPGA_PB1 (bidir), FPGA_PB2 (bidir), FPGA_PB3 (bidir), FPGA_PB4 (bidir), FPGA_PB5 (bidir), FPGA_PB6 (bidir), FPGA_PB7 (bidir), FPGA_PB8 (bidir), FPGA_PB9 (bidir), FPGA_PB10 (bidir), FPGA_PB11 (bidir), FPGA_PB12 (bidir), FPGA_PB13 (bidir), FPGA_PB14 (bidir), FPGA_PB15 (bidir), FPGA_RAS (bidir), FPGA_SCL (bidir), FPGA_SDA (bidir), FPGA_SIZ (out), FPGA_TR0 (out), FPGA_TR1 (out), FPGA_WR (out), MISO0 (bidir), MOSI0 (bidir), PGMB (in), SCLK0 (out), SCS0 (out), SSEL0 (out), SSEL1 (out), SSEL2 (out), USB_N (bidir), USB_P (bidir)

### Nets
1V2: C6.1 C7.1 C8.1 C9.1 C10.1 U1.1(VCC) U1.20(VCC) U1.48(VCC) U1.65(VCC) U1.85(VCC) U1.92(VCC) U1.113(VCC) U1.128(VCC) U1.137(VCC) U1.164(VCC)
2V5: C4.2 C11.1 C13.1 C14.1 C15.1 C16.1 C17.1 C18.1 C19.1 C20.1 C21.1 PD1.1(VDD) R2.2 R5.1 U1.7(VCCIO1) U1.12(VCCIO1) U1.18(VCCIO1) U1.24(VCCIO2) U1.34(VCCIO2) U1.40(VCCIO2) U1.96(VCCIO5) U1.105(VCCIO5) U1.108(VCCIO5) U1.117(VCCIO6) U1.120(VCCIO6) U1.125(VCCIO6) Y1.4(VDD)
D3V3: C1.2 C2.2 C3.2 C22.1 C27.1 C28.1 C29.1 C30.1 C31.1 C32.1 C33.1 C34.1 D1.2 L1.2 L2.2 L3.2 L4.2 R1.2 U1.59(VCCIO3) U1.67(VCCIO4) U1.80(VCCIO4) U1.142(VCCIO7) U1.154(VCCIO7) U1.160(VCCIO7) U1.167(VCCIO8) U1.171(VCCIO8) U1.172(ADC_REF) U2.3(~{WP}) U2.7(~{HOLD}) U2.8(VCC) U3.8(VCC) U4.4(VDD)
GND: C1.1 C2.1 C3.1 C4.1 C5.2 C6.2 C7.2 C8.2 C9.2 C10.2 C12.2 C13.2 C14.2 C15.2 C16.2 C17.2 C18.2 C19.2 C20.2 C21.2 C22.2 C23.2 C24.2 C25.2 C26.2 C27.2 C28.2 C29.2 C30.2 C31.2 C32.2 C33.2 C34.2 P1.2 P1.5 P1.8 P1.14 P1.19 P1.20 P1.25 P1.26 PD1.6(GND) R7.2 S1.1 U1.9(GND) U1.13(GND) U1.21(GND) U1.33(GND) U1.38(GND) U1.116(GND) U1.177(GND) U2.4(GND) U3.4(GND) U4.6(GND) U4.10(PAD1) U4.11(PAD2) U4.12(PAD3) U4.13(PAD4) Y1.2(GND)
CCLK: U1.168(IO/CCLK) U2.6(SCLK)
CCS: U1.140(IO/CSO_B/ELVDS17_N) U2.1(~{CS})
CMISO: U1.165(IO/D0_DIN_MISO) U2.2(MISO)
CMOSI: U1.166(IO/MOSI_CSI_B) U2.5(MOSI)
CRST: C5.1 R2.1 S1.2 U1.42(IO/LVDS10_P)
DDR_VREF: C11.2 C12.1 R5.2 R7.1 U1.5(DDR_VREF)
DONE: U1.10(IO/DONE/LVDS2_P) ; port DONE
DQMH: U1.88(IO/HSWAPEN) ; port FPGA_DQMH
DQML: U1.162(IO/D3/GCLKIOT_3/ELVDS24_P) ; port FPGA_DQML
FPGA_MB0: U1.86(IO/ELVDS14_P) ; port FPGA_MB0
FPGA_MB1: U1.84(IO/ELVDS14_N) ; port FPGA_MB1
FPGA_MB2: U1.83(IO/ELVDS13_P) ; port FPGA_MB2
FPGA_MB3: U1.82(IO/ELVDS13_N) ; port FPGA_MB3
FPGA_MB4: U1.81(IO/ELVDS12_N) ; port FPGA_MB4
FPGA_MB5: U1.79(IO/ELVDS12_P) ; port FPGA_MB5
FPGA_MB6: U1.78(IO/ELVDS11_P) ; port FPGA_MB6
FPGA_MB7: U1.77(IO/ELVDS11_N) ; port FPGA_MB7
FPGA_MB8: U1.76(IO/GPLL3_OUTP/ELVDS10_P) ; port FPGA_MB8
FPGA_MB9: U1.75(IO/GPLL3_OUTN/ELVDS10_N) ; port FPGA_MB9
FPGA_MB10: U1.74(IO/ELVDS9_N) ; port FPGA_MB10
FPGA_MB11: U1.73(IO/ELVDS9_P) ; port FPGA_MB11
FPGA_MB12: U1.72(IO) ; port FPGA_MB12
FPGA_MB13: U1.71(IO/ELVDS8_N) ; port FPGA_MB13
FPGA_MB14: U1.70(IO/ELVDS8_P) ; port FPGA_MB14
FPGA_MB15: U1.69(IO/ELVDS7_N) ; port FPGA_MB15
FPGA_TCK: R3.8 U1.47(IO/TCK)
FPGA_TDI: R3.7 U1.46(IO/TDI)
FPGA_TDO: R3.5 U1.43(IO/TDO)
FPGA_TMS: R3.6 U1.44(IO/TMS)
INITB: R1.1 U1.139(IO/INITB/ELVDS17_P) ; port ECINT#
LEDB: R6.3 U1.90(IO/GPLL3_CLKIN0/LVDS11_P)
LEDG: R6.2 U1.91(IO)
LEDR: R6.1 U1.93(IO/LVDS12_P)
LVDS0_N: P1.3 U1.101(IO/LVDS15_N)
LVDS0_P: P1.1 U1.100(IO/LVDS15_P)
LVDS1_N: P1.7 U1.102(IO/LVDS16_N)
LVDS1_P: P1.9 U1.103(IO/LVDS16_P)
LVDS2_N: P1.6 U1.107(IO/LVDS17_N)
LVDS2_P: P1.4 U1.106(IO/LVDS17_P)
LVDS3_N: P1.10 U1.110(IO/LVDS18_N)
LVDS3_P: P1.12 U1.111(IO/LVDS18_P)
LVDS4_N: P1.18 U1.122(IO/LVDS19_N)
LVDS4_P: P1.16 U1.121(IO/LVDS19_P)
LVDS5_N: P1.22 U1.123(IO/LVDS20_N)
LVDS5_P: P1.24 U1.124(IO/LVDS20_P)
LVDS6_N: P1.30 U1.127(IO/LVDS21_N)
LVDS6_P: P1.28 U1.126(IO/LVDS21_P)
LVDS7_N: P1.21 U1.129(IO/LVDS22_N)
LVDS7_P: P1.23 U1.130(IO/LVDS22_P)
LVDSC_N: P1.29 U1.132(IO/LVDS23_N)
LVDSC_P: P1.27 U1.131(IO/LVDS23_P)
MISO0: U1.58(IO/ELVDS4_P) ; port MISO0
MOSI0: U1.57(IO/ELVDS4_N) ; port MOSI0
PGMB: U1.134(IO/PROGRAM_B/ELVDS15_N) ; port PGMB
SCLK0: U1.60(IO/GCLKIOB_4/ELVDS5_N) ; port SCLK0
SCS0: U1.61(IO/GCLKIOB_5/ELVDS5_P) ; port SCS0
SDCLK: U1.53(IO/ELVDS3_P) U4.5(CLK)
SDCMD: U1.54(IO/ELVDS3_N) U4.3(CMD/MOSI)
SDDAT0: U1.52(IO/GPLL0_OUTP/ELVDS2_P) U4.7(DAT0/MISO)
SDDAT1: U1.51(IO/GPLL0_OUTN/ELVDS2_N) U4.8(DAT1)
SDDAT2: U1.56(IO) U4.1(DAT2)
SDDAT3: U1.55(IO) U4.2(DAT3/CS)
SSEL0: U1.64(IO) ; port SSEL0
SSEL1: U1.63(IO/GCLKIOB_3/ELVDS6_P) ; port SSEL1
SSEL2: U1.62(IO/GCLKIOB_2/ELVDS6_N) ; port SSEL2
UART2_RX: R4.2 U1.118(IO)
UART2_TX: R4.1 U1.119(IO)
UART3_RX: R4.4 U1.114(IO)
UART3_TX: R4.3 U1.115(IO)
UCS: U1.163(IO/D2/GCLKIOT_2/ELVDS24_N) U3.1(~{CS})
UMISO: U1.169(IO/M0) U3.2(MISO)
UMOSI: U1.173(IO/GPLL1_CLKIN0/ADC_CH_4) U3.5(MOSI)
UQPI2: U1.170(IO/M1/ADC_CH_0) U3.3(~{WP})
UQPI3: U1.176(IO/GPLL1_CLKIN1/ADC_CH_6) U3.7(~{HOLD})
USB_N: U1.50(IO/ELVDS1_P) ; port USB_N
USB_P: U1.49(IO/ELVDS1_N) ; port USB_P
USCLK: U1.174(IO/D2) U3.6(SCLK)
NetC23_1: C23.1 L1.1 U1.175(VCCAUX)
NetC24_1: C24.1 L2.1 U1.135(VCCAUX)
NetC25_1: C25.1 L3.1 U1.87(VCCAUX)
NetC26_1: C26.1 L4.1 U1.45(VCCAUX)
NetD1_1: D1.1 R6.8
NetD1_3: D1.3 R6.7
NetD1_4: D1.4 R6.6
NetP1_11: P1.11 R4.5
NetP1_13: P1.13 R4.6
NetP1_15: P1.15 R4.7
NetP1_17: P1.17 R4.8
NetP10_26: U1.161(IO/GCLKIOT_0) ; port FPGA_MWE
NetP10_27: U1.159(IO/GCLKIOT_5/ELVDS23_P) ; port FPGA_CAS
NetP10_28: U1.158(IO/GCLKIOT_4/ELVDS23_N) ; port FPGA_RAS
NetP10_29: U1.157(IO/GCLKIOT_7) ; port FPGA_MCSL
NetP10_30: U1.156(IO/D5/ELVDS22_P) ; port FPGA_BA0
NetP10_31: U1.155(IO/D6/ELVDS22_N) ; port FPGA_BA1
NetP10_32: U1.153(IO/ELVDS21_N) ; port FPGA_MA10
NetP10_33: U1.152(IO/D7/ELVDS21_P) ; port FPGA_MA0
NetP10_34: U1.151(IO) ; port FPGA_MA1
NetP10_35: U1.150(IO/ELVDS20_N) ; port FPGA_MA2
NetP10_36: U1.149(IO/ELVDS20_P) ; port FPGA_MA3
NetP10_37: U1.148(IO) ; port FPGA_MA4
NetP10_38: U1.147(IO/D4/ELVDS19_N) ; port FPGA_MA5
NetP10_39: U1.146(IO/D3/ELVDS19_P) ; port FPGA_MA6
NetP10_40: U1.145(IO/ELVDS18_N) ; port FPGA_MA7
NetP10_41: U1.144(IO/ELVDS18_P) ; port FPGA_MA8
NetP10_42: U1.143(IO) ; port FPGA_MA9
NetP10_43: U1.141(IO) ; port FPGA_MA11
NetP10_44: U1.138(IO/GPLL2_OUTN/ELVDS16_N) ; port FPGA_MCSU
NetP10_45: U1.136(IO/GPLL2_OUTP/ELVDS16_P) ; port FPGA_MCKE
NetP10_46: U1.133(IO/ELVDS15_P) ; port FPGA_MCLK
NetP10_71: U1.66(IO) ; port FPGA_SCL
NetP10_72: U1.68(IO/ELVDS7_P) ; port FPGA_SDA
NetPD1_2: PD1.2(TCK) R3.1
NetPD1_3: PD1.3(TDI) R3.2
NetPD1_4: PD1.4(TMS) R3.3
NetPD1_5: PD1.5(TDO) R3.4
NetU1_2: U1.2(IO/LVDS1_N) ; port FPGA_ERR
NetU1_3: U1.3(IO/LVDS1_P) ; port FPGA_SIZ
NetU1_4: U1.4(IO/LVDS24_N) ; port FPGA_TR1
NetU1_6: U1.6(IO/LVDS24_P) ; port FPGA_TR0
NetU1_8: U1.8(IO) ; port FPGA_DRQ
NetU1_11: U1.11(IO/LVDS2_N) ; port FPGA_INT
NetU1_14: U1.14(IO/LVDS3_P) ; port FPGA_AEN
NetU1_15: U1.15(IO/LVDS3_N) ; port FPGA_WR
NetU1_16: U1.16(IO/LVDS4_N) ; port FPGA_CS
NetU1_17: U1.17(IO/LVDS4_P) ; port FPGA_PB15
NetU1_19: U1.19(IO) ; port FPGA_BCLK
NetU1_22: U1.22(IO/GCLKIOL_5/LVDS5_P) ; port FPGA_PB14
NetU1_23: U1.23(IO/GCLKIOL_4/LVDS5_N) ; port FPGA_PB13
NetU1_25: U1.25(IO/GCLKIOL_6) ; port FPGA_PB12
NetU1_26: U1.26(IO/LVDS6_P) ; port FPGA_PB11
NetU1_27: U1.27(IO/LVDS6_N) ; port FPGA_PB10
NetU1_28: U1.28(IO/LVDS7_P) ; port FPGA_PB9
NetU1_29: U1.29(IO/LVDS7_N) ; port FPGA_PB8
NetU1_30: U1.30(IO/LVDS8_N) ; port FPGA_PB7
NetU1_31: U1.31(IO/LVDS8_P) ; port FPGA_PB6
NetU1_32: U1.32(IO) ; port FPGA_PB5
NetU1_35: U1.35(IO) ; port FPGA_PB4
NetU1_36: U1.36(IO/LVDS9_N) ; port FPGA_PB3
NetU1_37: U1.37(IO/LVDS9_P) ; port FPGA_PB2
NetU1_39: U1.39(IO) ; port FPGA_PB1
NetU1_41: U1.41(IO/LVDS10_N) ; port FPGA_PB0
NetU1_89: U1.89(IO/GPLL3_CLKIN1/LVDS11_N) Y1.3(OUT)
NetU1_94: U1.94(IO/LVDS12_N) ; port CEO4
NetU1_95: U1.95(IO/LVDS13_N) ; port CEO3
NetU1_97: U1.97(IO/LVDS13_P) ; port CEO2
NetU1_98: U1.98(IO/LVDS14_P) ; port CEO1
NetU1_99: U1.99(IO/LVDS14_N) ; port CEO0
NetU1_109: U1.109(IO) ; port CEO5

Not connected (* = marked no-connect by the designer): R6 4 5; U1 104(IO) 112(IO); U4 9(Sd); Y1 1(NC)*

### Layout directives
differential pair: LVDS0_N, LVDS0_P, LVDS1_N, LVDS1_P, LVDS2_N, LVDS2_P, LVDS3_N, LVDS3_P, LVDS4_N, LVDS4_P, LVDS5_N, LVDS5_P, LVDS6_N, LVDS6_P, LVDS7_N, LVDS7_P, LVDSC_N, LVDSC_P

### Notes on the sheet
- MACH32
- FPGA & Core Peripherals
- (in symbol EG4S10DDR, part A) BANK3; BANK 3/4/7/8
- (in symbol EG4S10DDR, part B) 2.5V IO; BANK 1/2/5/6
- (in symbol EG4S10DDR, part C) 1.2V VCore; V Flexible; Tied; 2.5/3.3V; Forced 2.5V IO

### Library data of the parts
C1-C21 C23-C34 = Cap: Capacitor; Published: 8-Jun-2000; LatestRevisionDate: 17-Jul-2002; LatestRevisionNote: Re-released for DXP Platform.; PackageReference: RAD-0.3; Publisher: Altium Limited; PackageDescription: Radial Cap, Thru-Hole; 2 Leads; 0.3 in Pin Spacing
C22 = Cap Pol1: Polarized Capacitor (Radial); Published: 8-Jun-2000; LatestRevisionDate: 17-Jul-2002; LatestRevisionNote: Re-released for DXP Platform.; PackageReference: RB7.6-15; Publisher: Altium Limited; PackageDescription: Polarized Capacitor (Radial); 2 Leads
D1 = LED3-CA
L1-L4 = Inductor: Code_IEC: 1005; Published: 8-Jun-2000; LatestRevisionDate: 29-May-2009; LatestRevisionNote: IPC-7351 Footprint Added.; PackageReference: 0402-A; Publisher: Altium Limited; PackageDescription: Chip Inductor; Code_JEITA: 0402
P1 = Header 15X2: Header, 15-Pin, Dual row; LatestRevisionDate: 17-Jul-2002; LatestRevisionNote: Re-released for DXP Platform.; Publisher: Altium Limited
R1 R2 R5 R7 = Res1: Resistor; Published: 8-Jun-2000; LatestRevisionDate: 17-Jul-2002; LatestRevisionNote: Re-released for DXP Platform.; PackageReference: AXIAL-0.3; Publisher: Altium Limited; PackageDescription: Axial Device, Thru-Hole; 2 Leads; 0.3 in Pin Spacing
R3 R4 R6 = ResPak-8P4R
S1 = SW-PB: Switch; Published: 24-Mar-1999; LatestRevisionDate: 17-Jul-2002; LatestRevisionNote: Re-released for DXP Platform.; PackageReference: SPST-2; Publisher: Altium Limited; PackageDescription: Switch; 2 Leads
U2 = W25Qxx: Bitstream
U3 = W25Qxx: Bootloader
Y1 = OSC

## Sheet MEM.SchDoc
size A4
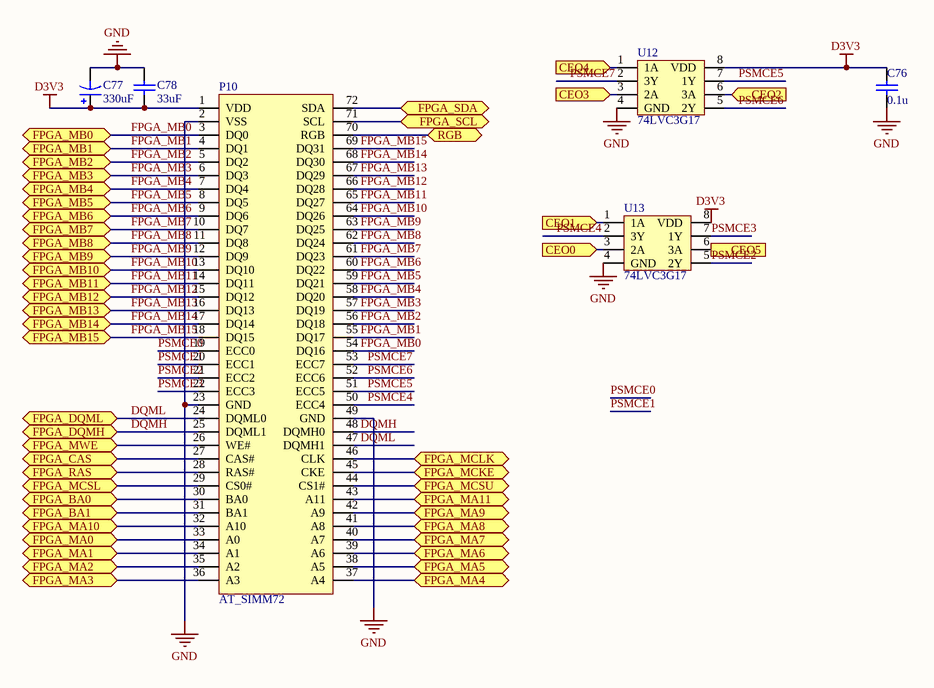
[diagram p3: MEM.SchDoc]

### Parts
C76  value 0.1u  [0603C]  (hidden comment: Cap)
C77  value 330uF  [TanCap-1210]  (hidden comment: 330u)
C78  value 33uF  [0603C]  (hidden comment: 106)
P10  AT_SIMM72  [ATSIMM72]
U12  74LVC3G17  [TSSOP-8N_3x3]
U13  74LVC3G17  [TSSOP-8N_3x3]

### Ports
CEO0 (in), CEO1 (in), CEO2 (in), CEO3 (in), CEO4 (in), CEO5 (in), FPGA_BA0 (bidir), FPGA_BA1 (bidir), FPGA_CAS (bidir), FPGA_DQMH (bidir), FPGA_DQML (bidir), FPGA_MA0 (bidir), FPGA_MA1 (bidir), FPGA_MA2 (bidir), FPGA_MA3 (bidir), FPGA_MA4 (bidir), FPGA_MA5 (bidir), FPGA_MA6 (bidir), FPGA_MA7 (bidir), FPGA_MA8 (bidir), FPGA_MA9 (bidir), FPGA_MA10 (bidir), FPGA_MA11 (bidir), FPGA_MB0 (bidir), FPGA_MB1 (bidir), FPGA_MB2 (bidir), FPGA_MB3 (bidir), FPGA_MB4 (bidir), FPGA_MB5 (bidir), FPGA_MB6 (bidir), FPGA_MB7 (bidir), FPGA_MB8 (bidir), FPGA_MB9 (bidir), FPGA_MB10 (bidir), FPGA_MB11 (bidir), FPGA_MB12 (bidir), FPGA_MB13 (bidir), FPGA_MB14 (bidir), FPGA_MB15 (bidir), FPGA_MCKE (bidir), FPGA_MCLK (bidir), FPGA_MCSL (bidir), FPGA_MCSU (bidir), FPGA_MWE (bidir), FPGA_RAS (bidir), FPGA_SCL (bidir), FPGA_SDA (bidir), RGB (bidir)

### Nets
D3V3: C76.2 C77.1 C78.2 P10.1(VDD) U12.8(VDD) U13.8(VDD)
GND: C76.1 C77.2 C78.1 P10.2(VSS) P10.23(GND) P10.49(GND) U12.4(GND) U13.4(GND)
DQMH: P10.25(DQML1) P10.48(DQMH0) ; port FPGA_DQMH
DQML: P10.24(DQML0) P10.47(DQMH1) ; port FPGA_DQML
FPGA_MB0: P10.3(DQ0) P10.54(DQ16) ; port FPGA_MB0
FPGA_MB1: P10.4(DQ1) P10.55(DQ17) ; port FPGA_MB1
FPGA_MB2: P10.5(DQ2) P10.56(DQ18) ; port FPGA_MB2
FPGA_MB3: P10.6(DQ3) P10.57(DQ19) ; port FPGA_MB3
FPGA_MB4: P10.7(DQ4) P10.58(DQ20) ; port FPGA_MB4
FPGA_MB5: P10.8(DQ5) P10.59(DQ21) ; port FPGA_MB5
FPGA_MB6: P10.9(DQ6) P10.60(DQ22) ; port FPGA_MB6
FPGA_MB7: P10.10(DQ7) P10.61(DQ23) ; port FPGA_MB7
FPGA_MB8: P10.11(DQ8) P10.62(DQ24) ; port FPGA_MB8
FPGA_MB9: P10.12(DQ9) P10.63(DQ25) ; port FPGA_MB9
FPGA_MB10: P10.13(DQ10) P10.64(DQ26) ; port FPGA_MB10
FPGA_MB11: P10.14(DQ11) P10.65(DQ27) ; port FPGA_MB11
FPGA_MB12: P10.15(DQ12) P10.66(DQ28) ; port FPGA_MB12
FPGA_MB13: P10.16(DQ13) P10.67(DQ29) ; port FPGA_MB13
FPGA_MB14: P10.17(DQ14) P10.68(DQ30) ; port FPGA_MB14
FPGA_MB15: P10.18(DQ15) P10.69(DQ31) ; port FPGA_MB15
PSMCE0: P10.19(ECC0)
PSMCE1: P10.20(ECC1)
PSMCE2: P10.21(ECC2) U13.5(2Y)
PSMCE3: P10.22(ECC3) U13.7(1Y)
PSMCE4: P10.50(ECC4) U13.2(3Y)
PSMCE5: P10.51(ECC5) U12.7(1Y)
PSMCE6: P10.52(ECC6) U12.5(2Y)
PSMCE7: P10.53(ECC7) U12.2(3Y)
NetP10_26: P10.26(WE#) ; port FPGA_MWE
NetP10_27: P10.27(CAS#) ; port FPGA_CAS
NetP10_28: P10.28(RAS#) ; port FPGA_RAS
NetP10_29: P10.29(CS0#) ; port FPGA_MCSL
NetP10_30: P10.30(BA0) ; port FPGA_BA0
NetP10_31: P10.31(BA1) ; port FPGA_BA1
NetP10_32: P10.32(A10) ; port FPGA_MA10
NetP10_33: P10.33(A0) ; port FPGA_MA0
NetP10_34: P10.34(A1) ; port FPGA_MA1
NetP10_35: P10.35(A2) ; port FPGA_MA2
NetP10_36: P10.36(A3) ; port FPGA_MA3
NetP10_37: P10.37(A4) ; port FPGA_MA4
NetP10_38: P10.38(A5) ; port FPGA_MA5
NetP10_39: P10.39(A6) ; port FPGA_MA6
NetP10_40: P10.40(A7) ; port FPGA_MA7
NetP10_41: P10.41(A8) ; port FPGA_MA8
NetP10_42: P10.42(A9) ; port FPGA_MA9
NetP10_43: P10.43(A11) ; port FPGA_MA11
NetP10_44: P10.44(CS1#) ; port FPGA_MCSU
NetP10_45: P10.45(CKE) ; port FPGA_MCKE
NetP10_46: P10.46(CLK) ; port FPGA_MCLK
NetP10_70: P10.70(RGB) ; port RGB
NetP10_71: P10.71(SCL) ; port FPGA_SCL
NetP10_72: P10.72(SDA) ; port FPGA_SDA
NetU1_94: U12.1(1A) ; port CEO4
NetU1_95: U12.3(2A) ; port CEO3
NetU1_97: U12.6(3A) ; port CEO2
NetU1_98: U13.1(1A) ; port CEO1
NetU1_99: U13.3(2A) ; port CEO0
NetU1_109: U13.6(3A) ; port CEO5

### Library data of the parts
C76 = Cap: Capacitor; Published: 8-Jun-2000; LatestRevisionDate: 17-Jul-2002; LatestRevisionNote: Re-released for DXP Platform.; PackageReference: RAD-0.3; Publisher: Altium Limited; PackageDescription: Radial Cap, Thru-Hole; 2 Leads; 0.3 in Pin Spacing
C77 = Cap Pol1: Polarized Capacitor (Radial); Published: 8-Jun-2000; LatestRevisionDate: 17-Jul-2002; LatestRevisionNote: Re-released for DXP Platform.; PackageReference: RB7.6-15; Publisher: Altium Limited; PackageDescription: Polarized Capacitor (Radial); 2 Leads
C78 = Cap: Ceramic Capacitor 0603; Published: 8-Jun-2000; LatestRevisionDate: 17-Jul-2002; LatestRevisionNote: Re-released for DXP Platform.; PackageReference: RAD-0.3; Publisher: Altium Limited; PackageDescription: Radial Cap, Thru-Hole; 2 Leads; 0.3 in Pin Spacing

## Nets that join several sheets
1V2: MISC (C62.1 C63.2 L7.2 R51.2), FPGA_CorePeripherals (15 pins)
2V5: AT short bus ( 7 x 4.2 inches) (U5.9 U5.25), MISC (6 pins), FPGA_CorePeripherals (27 pins)
2V5J: AT short bus ( 7 x 4.2 inches) (PD2.1), MISC (J1.2)
+5V: AT short bus ( 7 x 4.2 inches) (P2.B3), MISC (8 pins)
D3V3: AT short bus ( 7 x 4.2 inches) (18 pins), MISC (13 pins), FPGA_CorePeripherals (32 pins), MEM (6 pins)
GND: AT short bus ( 7 x 4.2 inches) (27 pins), MISC (67 pins), FPGA_CorePeripherals (59 pins), MEM (8 pins)
BRST: AT short bus ( 7 x 4.2 inches) (P2.B2), MISC (U8.56)
CPLD_CFG: AT short bus ( 7 x 4.2 inches) (U5.66), MISC (U8.24)
CPLD_DONE: AT short bus ( 7 x 4.2 inches) (U5.72), MISC (U8.25)
DONE: MISC (U8.9), FPGA_CorePeripherals (U1.10)
DQMH: FPGA_CorePeripherals (U1.88), MEM (P10.25 P10.48)
DQML: FPGA_CorePeripherals (U1.162), MEM (P10.24 P10.47)
FPGA_MB0: FPGA_CorePeripherals (U1.86), MEM (P10.3 P10.54)
FPGA_MB1: FPGA_CorePeripherals (U1.84), MEM (P10.4 P10.55)
FPGA_MB2: FPGA_CorePeripherals (U1.83), MEM (P10.5 P10.56)
FPGA_MB3: FPGA_CorePeripherals (U1.82), MEM (P10.6 P10.57)
FPGA_MB4: FPGA_CorePeripherals (U1.81), MEM (P10.7 P10.58)
FPGA_MB5: FPGA_CorePeripherals (U1.79), MEM (P10.8 P10.59)
FPGA_MB6: FPGA_CorePeripherals (U1.78), MEM (P10.9 P10.60)
FPGA_MB7: FPGA_CorePeripherals (U1.77), MEM (P10.10 P10.61)
FPGA_MB8: FPGA_CorePeripherals (U1.76), MEM (P10.11 P10.62)
FPGA_MB9: FPGA_CorePeripherals (U1.75), MEM (P10.12 P10.63)
FPGA_MB10: FPGA_CorePeripherals (U1.74), MEM (P10.13 P10.64)
FPGA_MB11: FPGA_CorePeripherals (U1.73), MEM (P10.14 P10.65)
FPGA_MB12: FPGA_CorePeripherals (U1.72), MEM (P10.15 P10.66)
FPGA_MB13: FPGA_CorePeripherals (U1.71), MEM (P10.16 P10.67)
FPGA_MB14: FPGA_CorePeripherals (U1.70), MEM (P10.17 P10.68)
FPGA_MB15: FPGA_CorePeripherals (U1.69), MEM (P10.18 P10.69)
INITB: MISC (U8.10), FPGA_CorePeripherals (R1.1 U1.139)
MISO0: MISC (P3.7 U6.6), FPGA_CorePeripherals (U1.58)
MOSI0: MISC (P3.5 U6.7), FPGA_CorePeripherals (U1.57)
NetP10_26: FPGA_CorePeripherals (U1.161), MEM (P10.26)
NetP10_27: FPGA_CorePeripherals (U1.159), MEM (P10.27)
NetP10_28: FPGA_CorePeripherals (U1.158), MEM (P10.28)
NetP10_29: FPGA_CorePeripherals (U1.157), MEM (P10.29)
NetP10_30: FPGA_CorePeripherals (U1.156), MEM (P10.30)
NetP10_31: FPGA_CorePeripherals (U1.155), MEM (P10.31)
NetP10_32: FPGA_CorePeripherals (U1.153), MEM (P10.32)
NetP10_33: FPGA_CorePeripherals (U1.152), MEM (P10.33)
NetP10_34: FPGA_CorePeripherals (U1.151), MEM (P10.34)
NetP10_35: FPGA_CorePeripherals (U1.150), MEM (P10.35)
NetP10_36: FPGA_CorePeripherals (U1.149), MEM (P10.36)
NetP10_37: FPGA_CorePeripherals (U1.148), MEM (P10.37)
NetP10_38: FPGA_CorePeripherals (U1.147), MEM (P10.38)
NetP10_39: FPGA_CorePeripherals (U1.146), MEM (P10.39)
NetP10_40: FPGA_CorePeripherals (U1.145), MEM (P10.40)
NetP10_41: FPGA_CorePeripherals (U1.144), MEM (P10.41)
NetP10_42: FPGA_CorePeripherals (U1.143), MEM (P10.42)
NetP10_43: FPGA_CorePeripherals (U1.141), MEM (P10.43)
NetP10_44: FPGA_CorePeripherals (U1.138), MEM (P10.44)
NetP10_45: FPGA_CorePeripherals (U1.136), MEM (P10.45)
NetP10_46: FPGA_CorePeripherals (U1.133), MEM (P10.46)
NetP10_71: MISC (U8.29), FPGA_CorePeripherals (U1.66), MEM (P10.71)
NetP10_72: MISC (U8.30), FPGA_CorePeripherals (U1.68), MEM (P10.72)
NetR52_1: AT short bus ( 7 x 4.2 inches) (U5.139), MISC (R52.1)
NetU1_2: AT short bus ( 7 x 4.2 inches) (U5.32), FPGA_CorePeripherals (U1.2)
NetU1_3: AT short bus ( 7 x 4.2 inches) (U5.31), FPGA_CorePeripherals (U1.3)
NetU1_4: AT short bus ( 7 x 4.2 inches) (U5.30), FPGA_CorePeripherals (U1.4)
NetU1_6: AT short bus ( 7 x 4.2 inches) (U5.29), FPGA_CorePeripherals (U1.6)
NetU1_8: AT short bus ( 7 x 4.2 inches) (U5.28), FPGA_CorePeripherals (U1.8)
NetU1_11: AT short bus ( 7 x 4.2 inches) (U5.27), FPGA_CorePeripherals (U1.11)
NetU1_14: AT short bus ( 7 x 4.2 inches) (U5.24), FPGA_CorePeripherals (U1.14)
NetU1_15: AT short bus ( 7 x 4.2 inches) (U5.23), FPGA_CorePeripherals (U1.15)
NetU1_16: AT short bus ( 7 x 4.2 inches) (U5.22), FPGA_CorePeripherals (U1.16)
NetU1_17: AT short bus ( 7 x 4.2 inches) (U5.21), FPGA_CorePeripherals (U1.17)
NetU1_19: AT short bus ( 7 x 4.2 inches) (U5.20), FPGA_CorePeripherals (U1.19)
NetU1_22: AT short bus ( 7 x 4.2 inches) (U5.18), FPGA_CorePeripherals (U1.22)
NetU1_23: AT short bus ( 7 x 4.2 inches) (U5.16), FPGA_CorePeripherals (U1.23)
NetU1_25: AT short bus ( 7 x 4.2 inches) (U5.15), FPGA_CorePeripherals (U1.25)
NetU1_26: AT short bus ( 7 x 4.2 inches) (U5.14), FPGA_CorePeripherals (U1.26)
NetU1_27: AT short bus ( 7 x 4.2 inches) (U5.13), FPGA_CorePeripherals (U1.27)
NetU1_28: AT short bus ( 7 x 4.2 inches) (U5.12), FPGA_CorePeripherals (U1.28)
NetU1_29: AT short bus ( 7 x 4.2 inches) (U5.11), FPGA_CorePeripherals (U1.29)
NetU1_30: AT short bus ( 7 x 4.2 inches) (U5.8), FPGA_CorePeripherals (U1.30)
NetU1_31: AT short bus ( 7 x 4.2 inches) (U5.7), FPGA_CorePeripherals (U1.31)
NetU1_32: AT short bus ( 7 x 4.2 inches) (U5.6), FPGA_CorePeripherals (U1.32)
NetU1_35: AT short bus ( 7 x 4.2 inches) (U5.5), FPGA_CorePeripherals (U1.35)
NetU1_36: AT short bus ( 7 x 4.2 inches) (U5.4), FPGA_CorePeripherals (U1.36)
NetU1_37: AT short bus ( 7 x 4.2 inches) (U5.3), FPGA_CorePeripherals (U1.37)
NetU1_39: AT short bus ( 7 x 4.2 inches) (U5.2), FPGA_CorePeripherals (U1.39)
NetU1_41: AT short bus ( 7 x 4.2 inches) (U5.1), FPGA_CorePeripherals (U1.41)
NetU1_94: FPGA_CorePeripherals (U1.94), MEM (U12.1)
NetU1_95: FPGA_CorePeripherals (U1.95), MEM (U12.3)
NetU1_97: FPGA_CorePeripherals (U1.97), MEM (U12.6)
NetU1_98: FPGA_CorePeripherals (U1.98), MEM (U13.1)
NetU1_99: FPGA_CorePeripherals (U1.99), MEM (U13.3)
NetU1_109: FPGA_CorePeripherals (U1.109), MEM (U13.6)
PGMB: MISC (U8.11), FPGA_CorePeripherals (U1.134)
SCLK0: MISC (P3.3 U6.8), FPGA_CorePeripherals (U1.60)
SCS0: MISC (U7.4), FPGA_CorePeripherals (U1.61)
SSEL0: MISC (U7.1), FPGA_CorePeripherals (U1.64)
SSEL1: MISC (U7.2), FPGA_CorePeripherals (U1.63)
SSEL2: MISC (U7.3), FPGA_CorePeripherals (U1.62)
USB_N: MISC (P6.2 R53.1), FPGA_CorePeripherals (U1.50)
USB_P: MISC (P6.3 R52.2 R54.1), FPGA_CorePeripherals (U1.49)